# Altium schematic sheet SAMV71_Xplained_Ultra_Power_Supply.SchDoc: Power supply
size A3; Organization: ATMEL Norway; Address1: Vestre Rosten 79; Address2: N-7075 TILLER; Address3: NORWAY; DocumentNumber: A09-2407; Revision: 11; SheetNumber: 2; SheetTotal: 13; DrawnBy: Microchip Norway; Engineer: AH; PageSetup: Record=PageOptions|CenterHorizontal=True|CenterVertical=True|PrintScale=1.01|XCorrection=1.00|YCorrection=1.00|PrintKind=1|BorderSize=5000000|LeftOffset=0|BottomOffset=0|Orientation=2|PaperLength=1000|PaperWidth=1000|Scale=100|PaperSource=7|PrintQuality=-4|MediaType=1|DitherType=10|PaperKind=A3 (297 x 420 mm)|PrintScaleMode=1; ProjectTitle: SAM V71 Xplained Ultra; PCBNumber: A08-2216; PCBRevision: 4
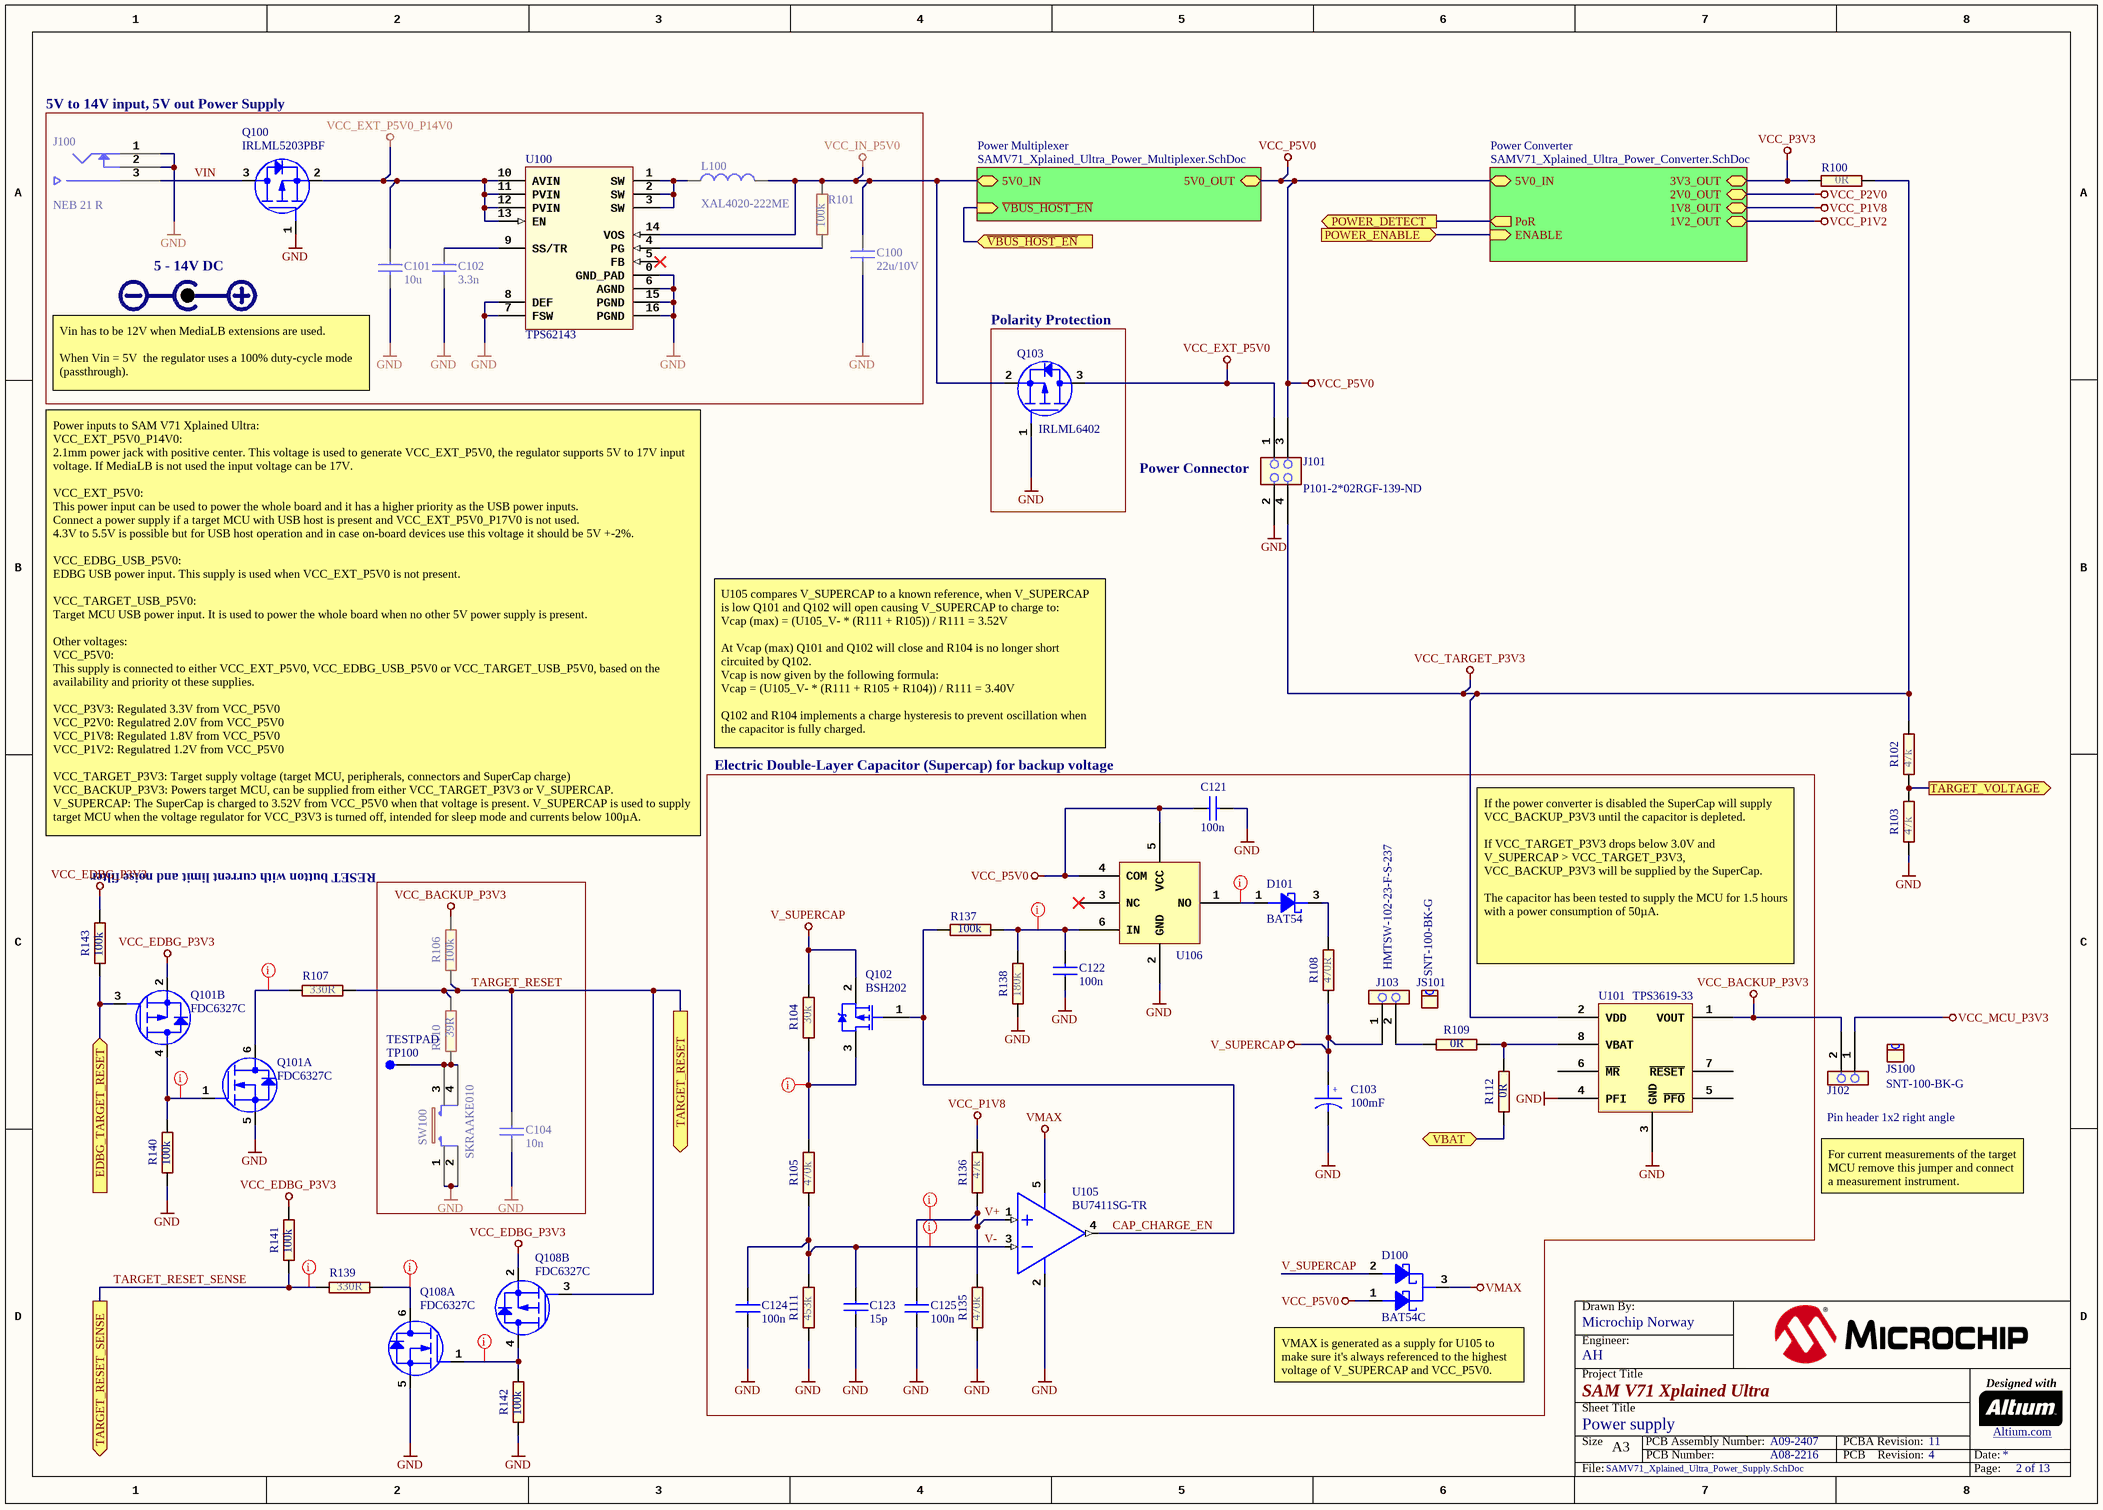
[diagram p0: SAMV71_Xplained_Ultra_Power_Supply.SchDoc]

## Parts
C100  value 22u/10V  [AP1-00003]
C101  value 10u  [AP1-00003]
C102  value 3.3n  [AP1-00001]
C103  value 100mF  [AP1-00122]
C104  value 10n  [AP1-00053]
C121  value 100n  [AP1-00001]
C122  value 100n  [AP1-00053]
C123  value 15p  [AP1-00001]
C124  value 100n  [AP1-00001]
C125  value 100n  [AP1-00001]
D100  value BAT54C  [AP5-00002]
D101  value BAT54  [AP4-00007]
J100  value NEB 21 R  [AP8-00853]
J101  value P101-2*02RGF-139-ND  [AP8-00628]
J102  value Pin header 1x2 right angle  [AP8-00367]
J103  value HMTSW-102-23-F-S-237  [AP8-00733]
JS100  value SNT-100-BK-G  [AP8-00525]
JS101  value SNT-100-BK-G  [AP8-00525]
L100  value XAL4020-222ME  [AP3-00119]
Q100  value IRLML5203PBF  [AP5-00002]
Q101  value FDC6327C  [AP5-00008]  (hidden comment: Farnell no: 9844856)  (parts A,B of 2)
Q102  value BSH202  [AP4-00018]
Q103  value IRLML6402  [AP5-00002]
Q108  value FDC6327C  [AP5-00008]  (hidden comment: Farnell no: 9844856)  (parts A,B of 2)
R100  value 0R  [AP2-00000]
R101  value 100k  [AP2-00000]
R102  value 47k  [AP2-00000]
R103  value 47k  [AP2-00000]
R104  value 30k  [AP2-00000]
R105  value 470k  [AP2-00000]
R106  value 100k  [AP2-00011]
R107  value 330R  [AP2-00011]
R108  value 470R  [AP2-00000]
R109  value 0R  [AP2-00000]
R110  value 39R  [AP2-00011]
R111  value 453k  [AP2-00000]
R112  value 0R  [AP2-00000]
R135  value 470k  [AP2-00000]
R136  value 47k  [AP2-00000]
R137  value 100k  [AP2-00011]
R138  value 180k  [AP2-00011]
R139  value 330R  [AP2-00011]
R140  value 100k  [AP2-00011]
R141  value 100k  [AP2-00011]
R142  value 100k  [AP2-00011]
R143  value 100k  [AP2-00011]
SW100  value SKRAAKE010  [AP8-00137]
TP100  value TESTPAD  [AP8-00010]  (no BOM)
U100  value TPS62143  [AP6-00313]  (hidden comment: 100% duty-cycle mode, supports input voltage close to 5V with 5V output!)
U101  value TPS3619-33  [AP6-00382]
U105  value BU7411SG-TR  [AP6-00087]
U106  (no value)  [AP6-00056]

## Blocks framed on the sheet
Polarity Protection: Q103
RESET button with current limit and noise filter: C104 R106 R110 SW100 TP100

## Sub-sheets
Power Converter = SAMV71_Xplained_Ultra_Power_Converter.SchDoc: 2V0_OUT (bidir), 3V3_OUT, 5V0_IN, 1V2_OUT, 1V8_OUT, ENABLE (in), PoR (out)
Power Multiplexer = SAMV71_Xplained_Ultra_Power_Multiplexer.SchDoc: ~{VBUS_HOST_EN} (in), 5V0_OUT, 5V0_IN

## Ports
EDBG_TARGET_RESET (in), POWER_DETECT (out), POWER_ENABLE (in), TARGET_RESET (out), TARGET_RESET_SENSE (out), TARGET_VOLTAGE (out), VBAT (bidir), ~{VBUS_HOST_EN} (in)

## Nets
GND: C100.2 C101.2 C102.2 C103.2 C104.2 C121.2 C122.1 C123.2 C124.1 C125.1 J100.1 J100.2 J101.2 Q100.1(G) Q101.5(S) Q103.1(G) Q108.5(S) R103.1 R111.1 R135.1 R138.1 R140.1 R142.1 SW100.1 SW100.2 U100.0(GND_PAD) U100.6(AGND) U100.7(FSW) U100.8(DEF) U100.15(PGND) U100.16(PGND) U101.3(GND) U101.4(PFI) U105.2(GND) U106.2(GND)
V_SUPERCAP: C103.1 D100.2(ANODE2) J103.1 Q102.2(S) R104.2 R108.2
VCC_BACKUP_P3V3: J102.2 R106.2 U101.1(VOUT)
VCC_EDBG_P3V3: Q101.2(S) Q108.2(S) R141.2 R143.2
VCC_EXT_P5V0: J101.1 Q103.3(D)
VCC_EXT_P5V0_P14V0: C101.1 Q100.2(S) U100.10(AVIN) U100.11(PVIN) U100.12(PVIN) U100.13(EN)
VCC_IN_P5V0: C100.1 L100.2 Q103.2(S) R101.1 U100.14(VOS) ; sheet Power Multiplexer/5V0_IN
VCC_MCU_P3V3: J102.1
VCC_P1V2: sheet Power Converter/1V2_OUT
VCC_P1V8: R136.2 ; sheet Power Converter/1V8_OUT
VCC_P2V0: sheet Power Converter/2V0_OUT
VCC_P3V3: R100.1 ; sheet Power Converter/3V3_OUT
VCC_P5V0: C121.1 D100.1(ANODE1) J101.3 U106.4(COM) U106.5(VCC) ; sheet Power Multiplexer/5V0_OUT, sheet Power Converter/5V0_IN
VCC_TARGET_P3V3: J101.4 R100.2 R102.2 U101.2(VDD)
VMAX: D100.3(CATHODE) U105.5(VCC)
CAP_CHARGE_EN: Q102.1(G) R137.1 U105.4(OUT)
EDBG_TARGET_RESET: Q101.3(G) R143.1 ; port EDBG_TARGET_RESET
POWER_DETECT: port POWER_DETECT, sheet Power Converter/PoR
POWER_ENABLE: port POWER_ENABLE, sheet Power Converter/ENABLE
TARGET_RESET: C104.1 Q108.3(G) R106.1 R107.2 R110.2 ; port TARGET_RESET
TARGET_RESET_SENSE: R139.1 R141.1 ; port TARGET_RESET_SENSE
TARGET_VOLTAGE: R102.1 R103.2 ; port TARGET_VOLTAGE
V+: C125.2 R135.2 R136.1 U105.1(IN+)
V-: C123.1 C124.2 R105.1 R111.2 U105.3(IN-)
~{VBUS_HOST_EN}: port ~{VBUS_HOST_EN}, sheet Power Multiplexer/~{VBUS_HOST_EN}
VBAT: R112.1 ; port VBAT
VIN: J100.3 Q100.3(D)
NetC102_1: C102.1 U100.9(SS/TR)
NetC122_2: C122.2 R137.2 R138.2 U106.6(IN)
NetD101_1: D101.1(ANODE) U106.1(NO)
NetD101_3: D101.3(CATHODE) R108.1
NetJ103_2: J103.2 R109.1
NetL100_1: L100.1 U100.1(SW) U100.2(SW) U100.3(SW)
NetQ101_1: Q101.1(G) Q101.4(D) R140.2
NetQ101_6: Q101.6(D) R107.1
NetQ102_3: Q102.3(D) R104.1 R105.2
NetQ108_1: Q108.1(G) Q108.4(D) R142.2
NetQ108_6: Q108.6(D) R139.2
NetR101_2: R101.2 U100.4(PG)
NetR109_2: R109.2 R112.2 U101.8(VBAT)
NetR110_1: R110.1 SW100.3 SW100.4 TP100.1

Not connected (* = marked no-connect by the designer): U100 5(FB)*; U101 5(~{PFO}) 6(~{MR}) 7(~{RESET}); U106 3(NC)*

## Layout directives
rule Fabrication Testpoint Usage [Testpoint - Not Allowed    Multiple - Not Allowed]; rule Assembly Testpoint Usage [Testpoint - Not Allowed    Multiple - Not Allowed]: NetC122_2, NetD101_1, NetQ102_3, V+, V-
rule Assembly Testpoint Usage [Testpoint - Not Allowed    Multiple - Not Allowed]; rule Fabrication Testpoint Usage [Testpoint - Not Allowed    Multiple - Not Allowed]: NetQ101_1, NetQ101_6, NetQ108_1, NetQ108_6, TARGET_RESET_SENSE

## Notes on the sheet
- (near J100) 5V to 14V input, 5V out Power Supply
- (near Q100) 5 - 14V DC
- (near C101) Vin has to be 12V when MediaLB extensions are used.
  When Vin = 5V  the regulator uses a 100% duty-cycle mode (passthrough).
- (near J101) Power Connector
- Electric Double-Layer Capacitor (Supercap) for backup voltage
- U105 compares V_SUPERCAP to a known reference, when V_SUPERCAP is low Q101 and Q102 will open causing V_SUPERCAP to charge to:
  Vcap (max) = (U105_V- * (R111 + R105)) / R111 = 3.52V
  At Vcap (max) Q101 and Q102 will close and R104 is no longer short circuited by Q102.
  Vcap is now given by the following formula:
  Vcap = (U105_V- * (R111 + R105 + R104)) / R111 = 3.40V
  Q102 and R104 implements a charge hysteresis to prevent oscillation when the capacitor is fully charged.
- Power inputs to SAM V71 Xplained Ultra:
  VCC_EXT_P5V0_P14V0:
  2.1mm power jack with positive center. This voltage is used to generate VCC_EXT_P5V0, the regulator supports 5V to 17V input voltage. If MediaLB is not used the input voltage can be 17V.
  VCC_EXT_P5V0:
  This power input can be used to power the whole board and it has a higher priority as the USB power inputs.
  Connect a power supply if a target MCU with USB host is present and VCC_EXT_P5V0_P17V0 is not used.
  4.3V to 5.5V is possible but for USB host operation and in case on-board devices use this voltage it should be 5V +-2%.
  VCC_EDBG_USB_P5V0:
  EDBG USB power input. This supply is used when VCC_EXT_P5V0 is not present.
  VCC_TARGET_USB_P5V0:
  Target MCU USB power input. It is used to power the whole board when no other 5V power supply is present.
  Other voltages:
  VCC_P5V0:
  This supply is connected to either VCC_EXT_P5V0, VCC_EDBG_USB_P5V0 or VCC_TARGET_USB_P5V0, based on the availability and priority ot these supplies.
  VCC_P3V3: Regulated 3.3V from VCC_P5V0
  VCC_P2V0: Regulatred 2.0V from VCC_P5V0
  VCC_P1V8: Regulated 1.8V from VCC_P5V0
  VCC_P1V2: Regulatred 1.2V from VCC_P5V0
  VCC_TARGET_P3V3: Target supply voltage (target MCU, peripherals, connectors and SuperCap charge)
  VCC_BACKUP_P3V3: Powers target MCU, can be supplied from either VCC_TARGET_P3V3 or V_SUPERCAP.
  V_SUPERCAP: The SuperCap is charged to 3.52V from VCC_P5V0 when that voltage is present. V_SUPERCAP is used to supply target MCU when the voltage regulator for VCC_P3V3 is turned off, intended for sleep mode and currents below 100µA.
- If the power converter is disabled the SuperCap will supply VCC_BACKUP_P3V3 until the capacitor is depleted.
  If VCC_TARGET_P3V3 drops below 3.0V and V_SUPERCAP > VCC_TARGET_P3V3, VCC_BACKUP_P3V3 will be supplied by the SuperCap.
  The capacitor has been tested to supply the MCU for 1.5 hours with a power consumption of 50µA.
- For current measurements of the target MCU remove this jumper and connect a measurement instrument.
- (near D100) VMAX is generated as a supply for U105 to make sure it's always referenced to the highest voltage of V_SUPERCAP and VCC_P5V0.
- Drawn By:
- Project Title
- Engineer:
- Designed with
- Sheet Title
- Size
- A3
- PCB Number:
- PCB Assembly Number:
- PCBA Revision:
- PCB    Revision:
- Date:
- Altium.com <http://go.altium.com/MicrochipLandingPage_Evaluation.html>
- File:
- Page:
- (in symbol A01-0679) +

## Library data of the parts
C100 = A01-0500: Ceramic capacitor, SMD 0805, X5R, 10V, Â±20%; PartGroup: Capacitors,Ceramic,SMD 0805; Manufacturer: tdk; MPN: C2012X5R1A226M/0.85; TemperatureRange: -55Â°C to +85Â°C; Status: Active; AN: A01-0500; Height: 0,949999988079071
C101 = A01-0634: Ceramic capacitor, SMD 0805, X5R, 25V, Â±10%; PartGroup: Capacitors,Ceramic,SMD 0805; Manufacturer: Murata; MPN: GRM21BR61E106KA73L; TemperatureRange: -55 Â°C to +85 Â°C; Status: Active; AN: A01-0634; Tolerance: Â±10%; Height: 1,25
C102 = A01-0044: Ceramic capacitor, SMD 0402, X7R, 25V, +/-10%; PartGroup: Capacitors,Ceramic,SMD 0402; Manufacturer: YAGEO CORP; MPN: CC0402KRX7R8BB332; TemperatureRange: -55 - +125 deg C; Status: Active; AN: A01-0044; Tolerance: 25V, +/-10%; Height: 0,550000011920929
C103 = A01-0679: Electric Double-Layer (Supercapacitor), 100mF, SMD, 10.5mm diameter, 25Î© ESR; PartGroup: Capacitors,Other; Manufacturer: Kemet; MPN: FC0H104ZFTBR24; Tolerance: -20/+80%; TemperatureRange: -25Â°C to +70Â°C; Status: Active; AN: A01-0679; Height: 5,5
C104 = A01-0050: Ceramic capacitor, SMD 0402, X7R, 25V, +/-10%; PartGroup: Capacitors,Ceramic,SMD 0402; Manufacturer: YAGEO CORP; MPN: CC0402KRX7R8BB103; TemperatureRange: -55 - +125 deg C; Status: Active; AN: A01-0050; Tolerance: 25V, +/-10%; Height: 0,550000011920929
C121 C122 C124 C125 = A01-0246: Ceramic capacitor, SMD 0402, X7R, 16V, +/-10%; PartGroup: Capacitors,Ceramic,SMD 0402; Manufacturer: Kemet; MPN: C0402C104K4RACTU; TemperatureRange: -55 - +125 deg C; Status: Active; AN: A01-0246; Tolerance: 16V, +/-10%; Height: 0,5
C123 = A01-0017: Ceramic capacitor, SMD 0402, NP0, 50V, +/-5%; PartGroup: Capacitors,Ceramic,SMD 0402; Manufacturer: AVX; MPN: 04025A150JAT2A; TemperatureRange: -55 - +125 deg C; Status: Active; AN: A01-0017; Tolerance: 50V, +/-5%; Height: 0,550000011920929
D100 = A04-0064: Schottky double Diodes, NXP, SOT23-3; PartGroup: Diodes,Schottky; Status: Active; AN: A04-0064; Height: 1; Manufacturer: NXP; MPN: BAT54C
D101 = A04-0001: Schottky diode, V(rrm)=30V, I(f)=0.1A, V(f)=0.4V (at If = 0.01A), I(r)=0.5uA (at Vrrm), t(rr)=5ns, SMD SOT23; PartGroup: Diodes,Schottky; Manufacturer: Philips; NC: 2; TemperatureRange: -40 - +85 deg C; Status: Active; AN: A04-0001; Height: 1,10000002384186; MPN: BAT54
J100 = A08-2120: Through hole DC jack 2.1mm, 12V, 3A; PartGroup: Mechanical devices,Connectors,Power; Manufacturer: Lumberg; TemperatureRange: -20Â°C to +70Â°C; Status: Active; AN: A08-2120; Height: 11; MPN: NEB 21 R
J101 = A08-1519: Pin header, 2x2, Right Angle, 2.54mm, THT, Pin In Paste; PartGroup: Mechanical devices,Connectors,Pin headers; Manufacturer: Pro-data International Corp; Status: Active; AN: A08-1519; Height: 5,07999992370605; MPN: P101-2*02RGF-139-ND
J102 = A08-0764: 1x2 pin header, right angle, 2.54 mm pitch, through-hole; PartGroup: Mechanical devices,Connectors,Pin headers; Manufacturer: Pro-data International Corp; MPN: 2213R-2G; Status: Active; AN: A08-0764; Height: 2,53999996185303
J103 = A08-1754: 1x2 pin header, 2.54mm pitch, Pin-in-Paste THM; PartGroup: Mechanical devices,Connectors,Pin headers; Manufacturer: SAMTEC; TemperatureRange: - 55 deg C to + 125 deg C; Status: Active; AN: A08-1754; Height: 6,09999990463257; MPN: HMTSW-102-23-F-S-237
JS100 JS101 = A08-0543: Jumper cap for 2.54mm pinheader; PartGroup: Mechanical devices,Mounting accessories,Other; Manufacturer: SAMTEC; Status: Active; AN: A08-0543; MPN: SNT-100-BK-G
L100 = A03-0197: 2.2ÂµH Shielded Power Inductor, 4x4x2mm, Isat=5.6A , Irms=4.0A , DCR=35.2mÎ©; PartGroup: Inductors,Power Inductors; Manufacturer: Coilcraft; MPN: XAL4020-222MEC; Tolerance: 20%; TemperatureRange: â€“40Â°C to +125Â°C; Status: Active; AN: A03-0197; Height: 2
Q100 = A05-0023: P-ch. MOSFET. -30V, -3.0A continuous, -24A Peak. RDS(ON)=0.098Ohm@VGS=-10V, RDS(ON)=0.165Ohm@VGS=-4.5V, -2.5V<VGS(th)<-1.0V; PartGroup: Transistors,Power FET,SMD; Manufacturer: International Rectifier; TemperatureRange: -40C to +125; Status: New; AN: A05-0023; Height: 1,12000000476837; MPN: IRLML5203PBF
Q101 Q108 = A05-0040: Dual N/P-ch MOSFET, 20V, 2.7A/-1.9A cont, 8A/-8A pulse, RDS(ON)<0.08/0.17Ohm@VGS=4.5V, VGS(th)<1.5/-1.5V, SSOT6; PartGroup: Transistors,Power FET,SMD; Manufacturer: Fairchild; TemperatureRange: -55 - +150 deg C; Status: New; AN: A05-0040; Height: 1,10000002384186; MPN: FDC6327C
Q102 = A05-0134: P-channel Power MOSFET,30V, 520mA continuous drain current; PartGroup: Transistors,Power FET,SMD; Manufacturer: NXP; Status: Verified; Design comment: *; AN: A05-0134; MPN: BSH202
Q103 = A05-0087: P-ch. MOSFET. -30V, -3.7A continuous,RDS(ON)=0.05Ohm@VGS=-4,5V, RDS(ON)=0.08Ohm@VGS=-2.5V; PartGroup: Transistors,Power FET,SMD; Manufacturer: International Rectifier; MPN: IRLML6402PBF; TemperatureRange: -55 - +150 deg C; Status: New; AN: A05-0087; Height: 1,14999997615814
R100 = A02-0163: Thick film resistor, SMD 0402, 1/16W, 1%; PartGroup: Resistors,SMD,0402 1%; Manufacturer: (n/a); MPN: RMCF0402ZT0R00; TemperatureRange: -55 - +125 deg C; Status: Active; AN: A02-0163; Tolerance: 1 %; Height: 0,349999994039536
R101 R106 R137 R140-R143 = A02-0260: Thick film resistor, SMD 0402, 1/16W, 1%; PartGroup: Resistors,SMD,0402 1%; Manufacturer: ASJ; MPN: CR10-1003-FK; TemperatureRange: -55ï¿½ to +125ï¿½C; Status: Active; AN: A02-0260; Tolerance: 1 %; Height: 0,349999994039536
R102 R103 R136 = A02-0252: Thick film resistor, SMD 0402, 1/16W, 1%; PartGroup: Resistors,SMD,0402 1%; Manufacturer: KOA; MPN: RK73H1ETTP4702F; TemperatureRange: -55 - +125 deg C; Status: Active; AN: A02-0252; Tolerance: 1 %; Height: 0,349999994039536
R104 = A02-0247: Thick film resistor, SMD 0402, 1/16W, 1%; PartGroup: Resistors,SMD,0402 1%; Manufacturer: ASJ; MPN: CR10-3002-FK; TemperatureRange: -55ï¿½ to +155ï¿½C; Status: Active; AN: A02-0247; Tolerance: 1 %; Height: 0,349999994039536
R105 R135 = A02-0276: Thick film resistor, SMD 0402, 1/16W, 1%; PartGroup: Resistors,SMD,0402 1%; Manufacturer: ASJ; MPN: CR10-4703-FK; TemperatureRange: -55 - +125 deg C; Status: Active; AN: A02-0276; Tolerance: 1 %; Height: 0,349999994039536
R107 R139 = A02-0200: Thick film resistor, SMD 0402, 1/16W, 1%; PartGroup: Resistors,SMD,0402 1%; Manufacturer: ASJ; MPN: CR10-3300-FK; TemperatureRange: -55 - +125 deg C; Status: Active; AN: A02-0200; Tolerance: 1 %; Height: 0,349999994039536
R108 = A02-0204: Thick film resistor, SMD 0402, 1/16W, 1%; PartGroup: Resistors,SMD,0402 1%; Manufacturer: ASJ; MPN: CR10-4700-FK; TemperatureRange: -55 - +125 deg C; Status: Active; AN: A02-0204; Tolerance: 1 %; Height: 0,349999994039536
R109 R112 = A02-0163: RES 0.0 OHM 1/16W 0402 SMD; PartGroup: Resistors,SMD,0402 1%; Manufacturer: (n/a); MPN: RMCF0402ZT0R00; Tolerance: 1 %; TemperatureRange: -55 - +125 deg C; Status: Active; AN: A02-0163; Height: 0,349999994039536
R110 = A02-0178: Thick film resistor, SMD 0402, 1/16W, 1%; PartGroup: Resistors,SMD,0402 1%; Manufacturer: ASJ; MPN: CR10-39R0-FK; TemperatureRange: -55 - +125 deg C; Status: Active; AN: A02-0178; Tolerance: 1 %; Height: 0,349999994039536
R111 = A02-0925: Thick film resistor, SMD 0402, 1/16W, 1%; PartGroup: Resistors,SMD,0402 1%; TemperatureRange: -55 - +125 deg C; Status: Active; AN: A02-0925; Tolerance: 1 %; Height: 0,349999994039536
R138 = A02-0266: Thick film resistor, SMD 0402, 1/16W, 1%; PartGroup: Resistors,SMD,0402 1%; Manufacturer: ASJ; MPN: CR10-1803-FK; TemperatureRange: -55 - +125 deg C; Status: Active; AN: A02-0266; Tolerance: 1 %; Height: 0,349999994039536
SW100 = A08-0790: 6.2x6.2 mm SMD tact switch, same as A08-0091 but less force is needed; PartGroup: Mechanical devices,Switches,SMD; Manufacturer: ALPS; TemperatureRange: -30 - +90 deg C; Status: Active; AN: A08-0790; Height: 5,09999990463257; MPN: SKRAAKE010
TP100 = A08-0004: Single SMD testpad; PartGroup: Mechanical devices,Connectors,Test points; Status: Active; AN: A08-0004; Height: 0
U100 = A06-1167: 5V to 17V in, 5V 2A out, Step-Down Converter; PartGroup: Integrated Circuits,Regulators,Switched; Manufacturer: Texas Instruments; MPN: TPS62143RGTR; TemperatureRange: -40C to 85C; AN: A06-1167; Height: 1
U101 = A06-1100: Backup battery supervisors for RAM retention; PartGroup: Integrated Circuits,Special function,Supervisor; Manufacturer: Texas Instruments; MPN: TPS3619-33DGK; Status: Verified; Design comment: *; AN: A06-1100
U105 = A06-1239: Single, Low Voltage (1.6-5.5V), Low Power (0.35ÂµA), low cost; PartGroup: Integrated Circuits,General linear,OP-AMP; Manufacturer: ROHM; TemperatureRange: -40Â°C to +105Â°C; Status: Active; AN: A06-1239; Height: 1,25; MPN: BU7411SG-TR
U106 = A06-1104: 1.65V to 5.5V SPDT Analog switch; PartGroup: Integrated Circuits,General linear,Analog switch, bus switch and MUX; Manufacturer: Texas Instruments; Value: TS5A3160DBVR; Status: Verified; Design comment: *; AN: A06-1104; MPN: TS5A3160DBVR